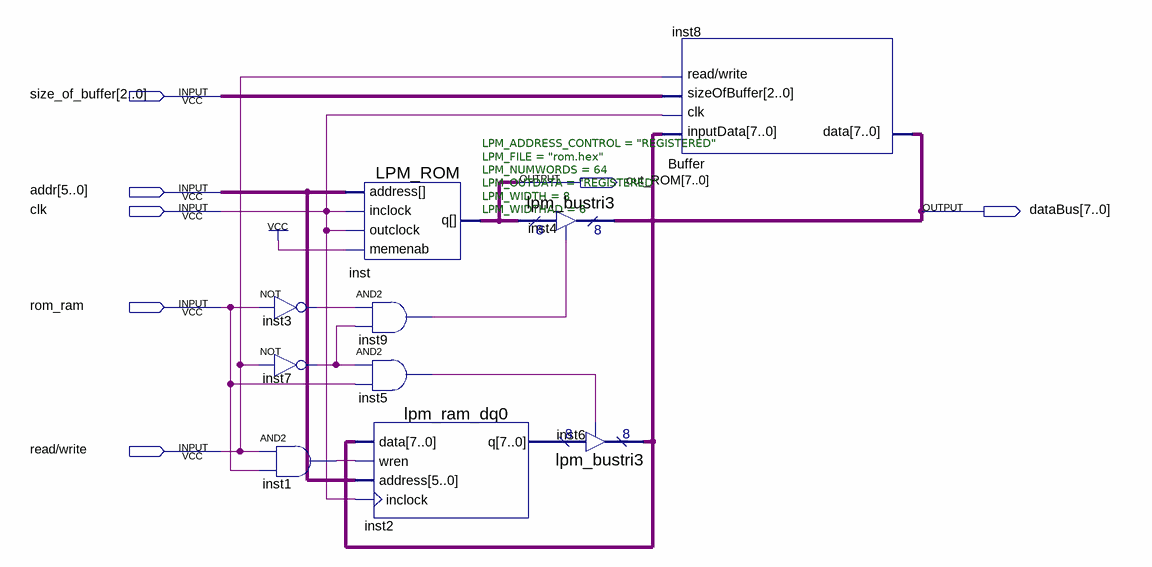
[diagram p0: schematic sheet]
// Quartus schematic MemoryBlock.bdf as structural Verilog: 10 symbols, 7 pins
module MemoryBlock (
  input  [2:0] size_of_buffer,
  input  [5:0] addr,
  input  clk,
  input  rom_ram,
  input  \read/write ,
  output [7:0] out_ROM,
  output [7:0] dataBus
);

  wire inst1_out, inst3_out, inst5_out, inst7_out, inst9_out;
  wire [7:0] inst2_q;

  not inst3 (inst3_out, rom_ram);
  not inst7 (inst7_out, \read/write );
  and inst1 (inst1_out, \read/write , rom_ram);
  LPM_ROM #(.LPM_ADDRESS_CONTROL("REGISTERED"), .LPM_FILE("rom.hex"), .LPM_NUMWORDS(64), .LPM_OUTDATA("REGISTERED"), .LPM_WIDTH(8), .LPM_WIDTHAD(6)) inst (
    .address(addr), .inclock(clk), .outclock(clk), .memenab(1'b1), .q(out_ROM));
  and inst9 (inst9_out, inst3_out, inst7_out);
  and inst5 (inst5_out, inst7_out, rom_ram);
  lpm_ram_dq0 inst2 (.data(dataBus), .wren(inst1_out), .address(addr), .inclock(clk), .q(inst2_q));
  lpm_bustri3 inst4 (.enabledt(inst9_out), .data(out_ROM), .tridata(dataBus));
  lpm_bustri3 inst6 (.enabledt(inst5_out), .data(inst2_q), .tridata(dataBus));
  Buffer inst8 (
    .inputData(dataBus), .clk(clk), .sizeOfBuffer(size_of_buffer), .\read/write (\read/write ), .data(dataBus));
endmodule
